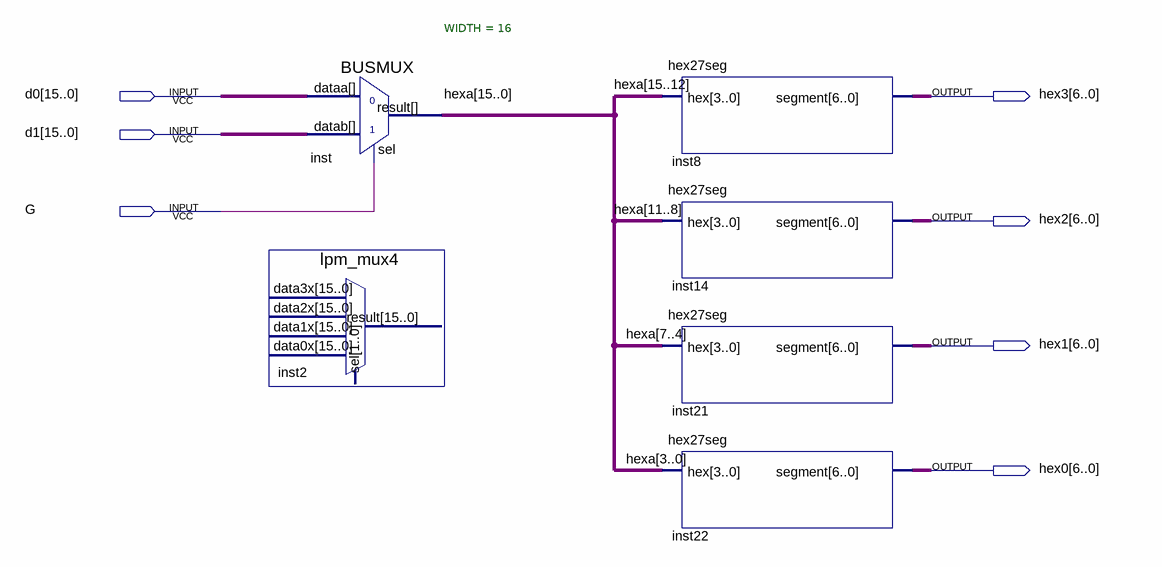
[diagram p0: schematic sheet]
// Quartus schematic display_select_control.bdf as structural Verilog: 6 symbols, 7 pins
module display_select_control (
  input  [15:0] d0,
  input  [15:0] d1,
  input  G,
  output [6:0] hex3,
  output [6:0] hex2,
  output [6:0] hex1,
  output [6:0] hex0
);

  wire [15:0] hexa;

  lpm_mux4 inst2 ();  // open: data3x, data2x, data1x, data0x, sel, result
  BUSMUX #(.WIDTH(16)) inst (.datab(d1), .sel(G), .dataa(d0), .result(hexa));
  hex27seg inst8 (.hex(hexa[15:12]), .segment(hex3));
  hex27seg inst14 (.hex(hexa[11:8]), .segment(hex2));
  hex27seg inst21 (.hex(hexa[7:4]), .segment(hex1));
  hex27seg inst22 (.hex(hexa[3:0]), .segment(hex0));
endmodule
